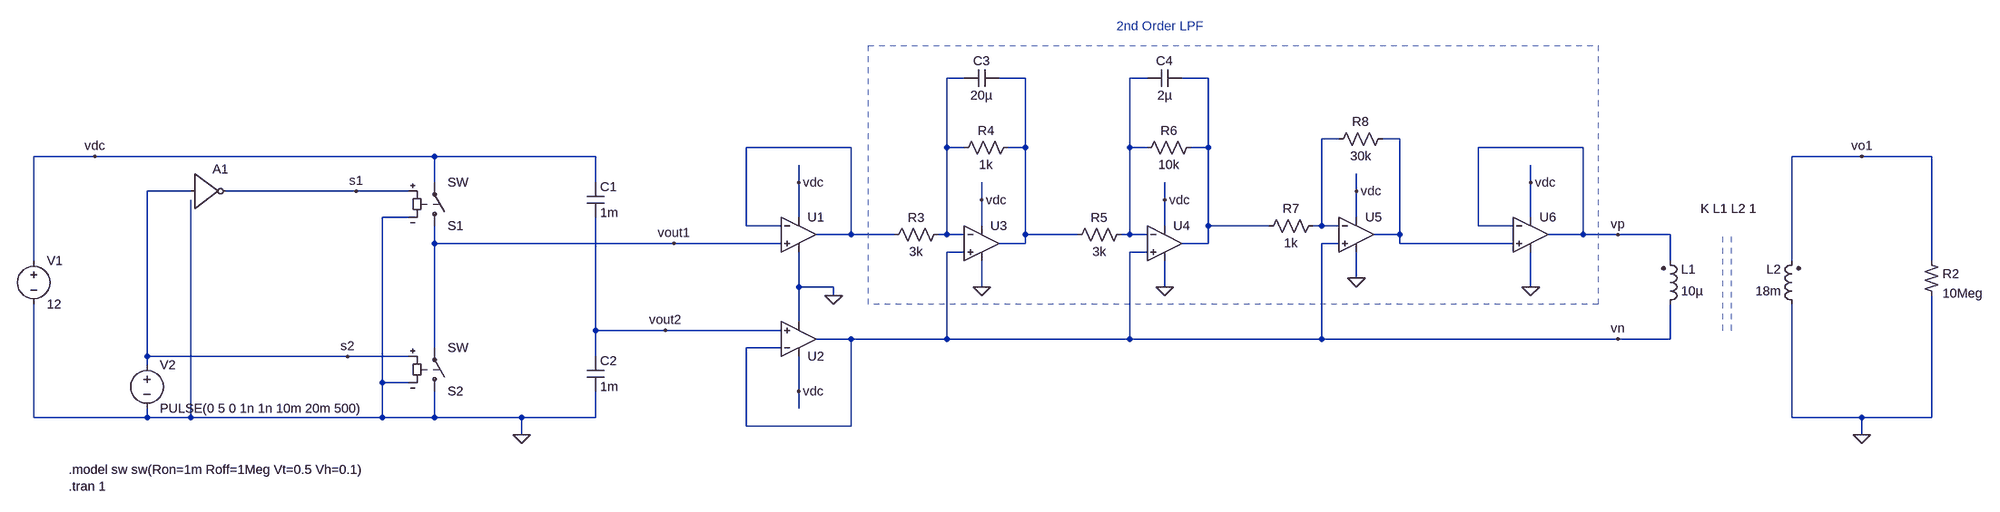
[diagram p0: schematic single-phase-inverter_v0p2.asc]
single-phase-inverter_v0p2.asc, the LTspice schematic file:
Version 4
SHEET 1 3488 716
WIRE 1424 -64 1392 -64
WIRE 1536 -64 1488 -64
WIRE 1760 -64 1728 -64
WIRE 1872 -64 1824 -64
WIRE 2112 48 2080 48
WIRE 2224 48 2192 48
WIRE 1216 64 1024 64
WIRE 1392 64 1392 -64
WIRE 1424 64 1392 64
WIRE 1536 64 1536 -64
WIRE 1536 64 1504 64
WIRE 1728 64 1728 -64
WIRE 1760 64 1728 64
WIRE 1872 64 1872 -64
WIRE 1872 64 1840 64
WIRE 2560 64 2368 64
WIRE -256 80 -368 80
WIRE 368 80 -256 80
WIRE 672 80 368 80
WIRE 3072 80 2944 80
WIRE 3200 80 3072 80
WIRE 368 128 368 80
WIRE 672 128 672 80
WIRE 1120 128 1120 96
WIRE 2464 128 2464 96
WIRE -80 144 -160 144
WIRE 224 144 -16 144
WIRE 320 144 224 144
WIRE 2144 144 2144 112
WIRE 1456 160 1456 128
WIRE 1792 160 1792 128
WIRE 320 192 272 192
WIRE 1120 192 1120 128
WIRE 2144 192 2144 144
WIRE 2464 192 2464 128
WIRE 1024 208 1024 64
WIRE 1088 208 1024 208
WIRE 1456 208 1456 160
WIRE 1792 208 1792 160
WIRE 1872 208 1872 64
WIRE 1984 208 1872 208
WIRE 2080 208 2080 48
WIRE 2080 208 2064 208
WIRE 2112 208 2080 208
WIRE 2368 208 2368 64
WIRE 2432 208 2368 208
WIRE 1216 224 1216 64
WIRE 1216 224 1152 224
WIRE 1296 224 1216 224
WIRE 1392 224 1392 64
WIRE 1392 224 1376 224
WIRE 1424 224 1392 224
WIRE 1536 224 1536 64
WIRE 1632 224 1536 224
WIRE 1728 224 1728 64
WIRE 1728 224 1712 224
WIRE 1760 224 1728 224
WIRE 2224 224 2224 48
WIRE 2224 224 2176 224
WIRE 2560 224 2560 64
WIRE 2560 224 2496 224
WIRE 2624 224 2560 224
WIRE 2720 224 2624 224
WIRE 368 240 368 208
WIRE 816 240 368 240
WIRE 1088 240 816 240
WIRE 1536 240 1536 224
WIRE 1536 240 1488 240
WIRE 1872 240 1872 208
WIRE 1872 240 1824 240
WIRE 2112 240 2080 240
WIRE 2224 240 2224 224
WIRE 2432 240 2224 240
WIRE 1424 256 1392 256
WIRE 1760 256 1728 256
WIRE -368 272 -368 80
WIRE 2720 272 2720 224
WIRE 2944 272 2944 80
WIRE 3200 272 3200 80
WIRE 2144 304 2144 256
WIRE 1120 320 1120 256
WIRE 1184 320 1120 320
WIRE 1456 320 1456 272
WIRE 1792 320 1792 272
WIRE 2464 320 2464 256
WIRE 1184 336 1184 320
WIRE 1120 384 1120 320
WIRE 672 400 672 192
WIRE 800 400 672 400
WIRE 1088 400 800 400
WIRE 1216 416 1152 416
WIRE 1392 416 1392 256
WIRE 1392 416 1216 416
WIRE 1728 416 1728 256
WIRE 1728 416 1392 416
WIRE 2080 416 2080 240
WIRE 2080 416 1728 416
WIRE 2624 416 2080 416
WIRE 2720 416 2720 352
WIRE 2720 416 2624 416
WIRE 368 432 368 240
WIRE 1088 432 1024 432
WIRE -160 448 -160 144
WIRE 208 448 -160 448
WIRE 320 448 208 448
WIRE 672 448 672 400
WIRE -160 464 -160 448
WIRE 272 496 272 192
WIRE 320 496 272 496
WIRE 1120 512 1120 448
WIRE 1120 544 1120 512
WIRE -368 560 -368 352
WIRE -160 560 -160 544
WIRE -160 560 -368 560
WIRE -80 560 -80 160
WIRE -80 560 -160 560
WIRE 272 560 272 496
WIRE 272 560 -80 560
WIRE 368 560 368 512
WIRE 368 560 272 560
WIRE 528 560 368 560
WIRE 672 560 672 512
WIRE 672 560 528 560
WIRE 2944 560 2944 352
WIRE 3072 560 2944 560
WIRE 3200 560 3200 336
WIRE 3200 560 3072 560
WIRE 1024 576 1024 432
WIRE 1216 576 1216 416
WIRE 1216 576 1024 576
WIRE 528 592 528 560
WIRE 3072 592 3072 560
FLAG 224 144 s1
FLAG 208 448 s2
FLAG -256 80 vdc
FLAG 816 240 vout1
FLAG 800 400 vout2
FLAG 528 592 0
FLAG 1120 128 vdc
FLAG 3072 80 vo1
FLAG 2624 224 vp
FLAG 2624 416 vn
FLAG 1120 512 vdc
FLAG 1184 336 0
FLAG 3072 592 0
FLAG 1456 320 0
FLAG 1456 160 vdc
FLAG 1792 320 0
FLAG 1792 160 vdc
FLAG 2144 304 0
FLAG 2144 144 vdc
FLAG 2464 128 vdc
FLAG 2464 320 0
SYMBOL sw 368 224 M180
SYMATTR InstName S1
SYMATTR SpiceModel sw
SYMBOL sw 368 528 M180
SYMATTR InstName S2
SYMATTR SpiceModel sw
SYMBOL cap 656 128 R0
SYMATTR InstName C1
SYMATTR Value 1m
SYMATTR SpiceLine Rser=1m Rpar=10Meg
SYMBOL cap 656 448 R0
SYMATTR InstName C2
SYMATTR Value 1m
SYMATTR SpiceLine Rser=1m Rpar=10Meg
SYMBOL voltage -368 256 R0
SYMATTR InstName V1
SYMATTR Value 12
SYMATTR SpiceLine Rser=1m
SYMBOL voltage -160 448 R0
SYMATTR InstName V2
SYMATTR Value PULSE(0 5 0 1n 1n 10m 20m 500)
SYMBOL Digital/inv -80 80 R0
WINDOW 3 8 54 Left 2
SYMATTR InstName A1
SYMATTR SpiceLine VHIGH = 5
SYMBOL OpAmps/UniversalOpAmp 1120 224 R0
SYMATTR InstName U1
SYMBOL ind2 2704 368 M180
WINDOW 0 36 80 Left 2
WINDOW 3 36 40 Left 2
SYMATTR InstName L1
SYMATTR Value 10µ
SYMATTR SpiceLine Rser=1m
SYMBOL ind2 2960 368 R180
WINDOW 0 36 80 Left 2
WINDOW 3 36 40 Left 2
SYMATTR InstName L2
SYMATTR Value 18m
SYMATTR SpiceLine Rser=1m
SYMBOL res2 3184 272 R0
SYMATTR InstName R2
SYMATTR Value 10Meg
SYMBOL OpAmps/UniversalOpAmp 1120 416 M180
SYMATTR InstName U2
SYMBOL OpAmps/UniversalOpAmp 1456 240 R0
SYMATTR InstName U3
SYMBOL res 1392 208 R90
WINDOW 0 0 56 VBottom 2
WINDOW 3 32 56 VTop 2
SYMATTR InstName R3
SYMATTR Value 3k
SYMBOL res 1520 48 R90
WINDOW 0 0 56 VBottom 2
WINDOW 3 32 56 VTop 2
SYMATTR InstName R4
SYMATTR Value 1k
SYMBOL cap 1488 -80 R90
WINDOW 0 0 32 VBottom 2
WINDOW 3 32 32 VTop 2
SYMATTR InstName C3
SYMATTR Value 20µ
SYMBOL OpAmps/UniversalOpAmp 1792 240 R0
SYMATTR InstName U4
SYMBOL res 1728 208 R90
WINDOW 0 0 56 VBottom 2
WINDOW 3 32 56 VTop 2
SYMATTR InstName R5
SYMATTR Value 3k
SYMBOL res 1856 48 R90
WINDOW 0 0 56 VBottom 2
WINDOW 3 32 56 VTop 2
SYMATTR InstName R6
SYMATTR Value 10k
SYMBOL cap 1824 -80 R90
WINDOW 0 0 32 VBottom 2
WINDOW 3 32 32 VTop 2
SYMATTR InstName C4
SYMATTR Value 2µ
SYMBOL OpAmps/UniversalOpAmp 2144 224 R0
SYMATTR InstName U5
SYMBOL res 2080 192 R90
WINDOW 0 0 56 VBottom 2
WINDOW 3 32 56 VTop 2
SYMATTR InstName R7
SYMATTR Value 1k
SYMBOL res 2208 32 R90
WINDOW 0 0 56 VBottom 2
WINDOW 3 32 56 VTop 2
SYMATTR InstName R8
SYMATTR Value 30k
SYMBOL OpAmps/UniversalOpAmp 2464 224 R0
SYMATTR InstName U6
TEXT -304 656 Left 2 !.model sw sw(Ron=1m Roff=1Meg Vt=0.5 Vh=0.1)\n.tran 1
TEXT 2776 176 Left 2 !K L1 L2 1
TEXT 1704 -160 Left 2 ;2nd Order LPF
LINE Normal 2816 228 2816 400 2
LINE Normal 2832 228 2832 400 2
RECTANGLE Normal 1248 -124 2588 352 2

The netlist it stands for:
* single-phase-inverter_v0p2.asc
S1 vout1 vdc s1 0 sw SW
S2 0 vout1 s2 0 sw SW
C1 vdc vout2 1m Rser=1m Rpar=10Meg
C2 vout2 0 1m Rser=1m Rpar=10Meg
V1 vdc 0 12 Rser=1m
V2 s2 0 PULSE(0 5 0 1n 1n 10m 20m 500)
A1 s2 0 0 0 0 s1 0 0 BUF VHIGH = 5
XU1 vout1 N007 vdc 0 N007 level1 Avol=1Meg GBW=10Meg Vos=0 En=0 Enk=0 In=0 Ink=0 Rin=500Meg  ; pins In+ In- V+ V- OUT
L1 vn vp 10µ Rser=1m
L2 0 vo1 18m Rser=1m
R2 vo1 0 10Meg
XU2 vout2 vn vdc 0 vn level1 Avol=1Meg GBW=10Meg Vos=0 En=0 Enk=0 In=0 Ink=0 Rin=500Meg  ; pins In+ In- V+ V- OUT
XU3 vn N001 vdc 0 N002 level1 Avol=1Meg GBW=10Meg Vos=0 En=0 Enk=0 In=0 Ink=0 Rin=500Meg  ; pins In+ In- V+ V- OUT
R3 N001 N007 3k
R4 N002 N001 1k
C3 N002 N001 20µ
XU4 vn N003 vdc 0 N004 level1 Avol=1Meg GBW=10Meg Vos=0 En=0 Enk=0 In=0 Ink=0 Rin=500Meg  ; pins In+ In- V+ V- OUT
R5 N003 N002 3k
R6 N004 N003 10k
C4 N004 N003 2µ
XU5 vn N005 vdc 0 N006 level1 Avol=1Meg GBW=10Meg Vos=0 En=0 Enk=0 In=0 Ink=0 Rin=500Meg  ; pins In+ In- V+ V- OUT
R7 N005 N004 1k
R8 N006 N005 30k
XU6 N006 vp vdc 0 vp level1 Avol=1Meg GBW=10Meg Vos=0 En=0 Enk=0 In=0 Ink=0 Rin=500Meg  ; pins In+ In- V+ V- OUT
.model sw sw(Ron=1m Roff=1Meg Vt=0.5 Vh=0.1)
.tran 1
K L1 L2 1
* 2nd Order LPF
.lib UniversalOpAmp1.lib
.backanno
.end